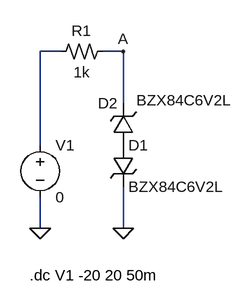
[diagram p0: schematic 1NZener.asc]
1NZener.asc, the LTspice schematic file:
Version 4
SHEET 1 1540 680
WIRE 96 -32 64 -32
WIRE 192 -32 160 -32
WIRE 192 48 192 -32
WIRE 64 112 64 -32
WIRE 64 240 64 192
WIRE 192 240 192 176
FLAG 64 240 0
FLAG 192 240 0
FLAG 192 -32 A
SYMBOL voltage 64 96 R0
SYMATTR InstName V1
SYMATTR Value 0
SYMBOL zener 176 112 R0
SYMATTR InstName D1
SYMATTR Value BZX84C6V2L
SYMBOL zener 208 112 R180
WINDOW 0 24 64 Left 2
WINDOW 3 -151 69 Left 2
SYMATTR InstName D2
SYMATTR Value BZX84C6V2L
SYMBOL res2 160 -48 R90
WINDOW 0 0 32 VBottom 2
WINDOW 3 32 32 VTop 2
SYMATTR InstName R1
SYMATTR Value 1k
TEXT 48 312 Left 2 !.dc V1 -20 20 50m

The netlist it stands for:
* 1NZener.asc
V1 N001 0 0
D1 P001 0 BZX84C6V2L
D2 P001 A BZX84C6V2L
R1 A N001 1k
.model D D
.lib standard.dio
.dc V1 -20 20 50m
.backanno
.end